# EAGLE design RPI_Clock (EAGLE 8.5.2)
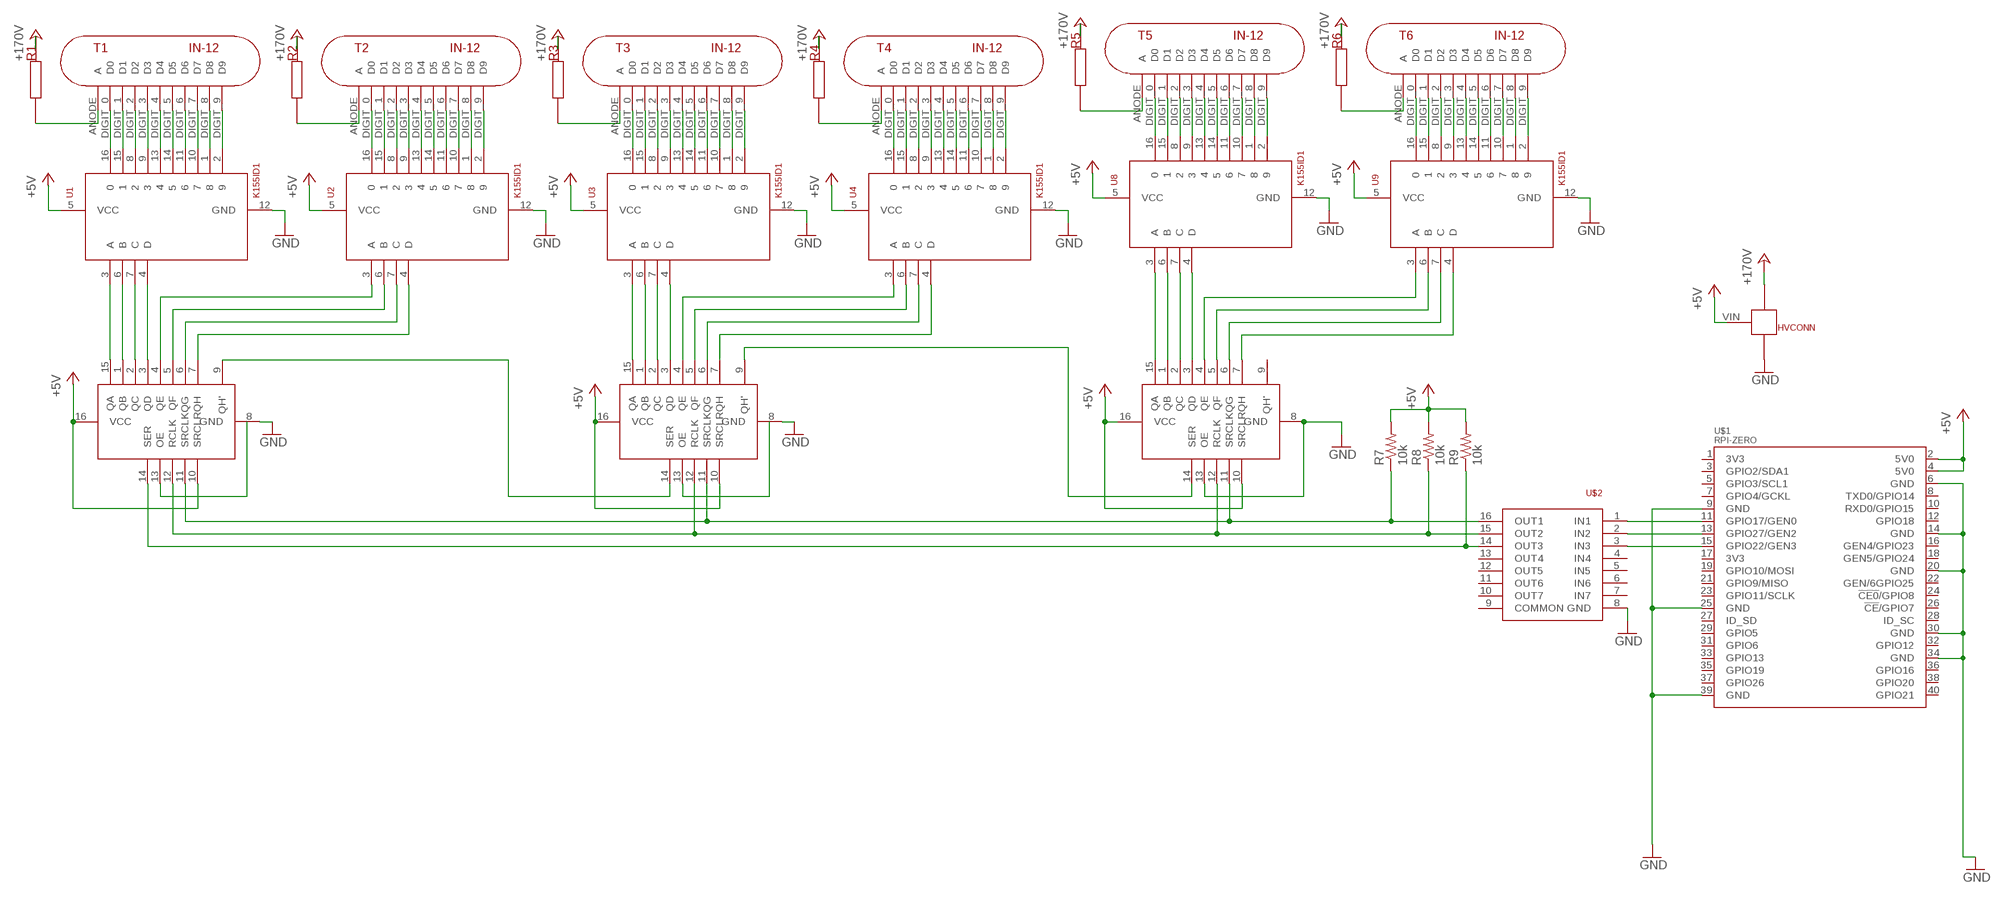
[diagram p0: schematic, sheet 1]

## Parts
HVCONN  HV_CONNECTOR  [HV_CONNECTOR]
R1  5,6K  ANODE_RESISTOR  [ANODE_RESISTOR]
R2  5,6K  ANODE_RESISTOR  [ANODE_RESISTOR]
R3  5,6K  ANODE_RESISTOR  [ANODE_RESISTOR]
R4  5,6K  ANODE_RESISTOR  [ANODE_RESISTOR]
R5  5,6K  ANODE_RESISTOR  [ANODE_RESISTOR]
R6  5,6K  ANODE_RESISTOR  [ANODE_RESISTOR]
R7  10k  RESISTOR0805  [0805]
R8  10k  RESISTOR0805  [0805]
R9  10k  RESISTOR0805  [0805]
T1  IN-12  [IN-12]
T2  IN-12  [IN-12]
T3  IN-12  [IN-12]
T4  IN-12  [IN-12]
T5  IN-12  [IN-12]
T6  IN-12  [IN-12]
U1  K155ID1  [DIP16-2.54-19.2X7.62MM]
U2  K155ID1  [DIP16-2.54-19.2X7.62MM]
U3  K155ID1  [DIP16-2.54-19.2X7.62MM]
U4  K155ID1  [DIP16-2.54-19.2X7.62MM]
U6  74HC595  [DIL16]
U7  74HC595  [DIL16]
U8  K155ID1  [DIP16-2.54-19.2X7.62MM]
U9  K155ID1  [DIP16-2.54-19.2X7.62MM]
U11  74HC595  [DIL16]
U$1  RPI-ZERO  [RASP_PI_ZERO_BOARD_FULL]
U$2  ULN2003D1013TR  [SO16-NARROW]

## Nets
+5V: HVCONN.VIN R7.2 R8.2 R9.2 U1.5(VCC) U2.5(VCC) U3.5(VCC) U4.5(VCC) U6.10(SRCLR) U6.16(VCC) U7.10(SRCLR) U7.16(VCC) U8.5(VCC) U9.5(VCC) U11.10(SRCLR) U11.16(VCC) U$1.2(5V0) U$1.4(5V0)
+24V: HVCONN.+170V R1.P$2 R2.P$2 R3.P$2 R4.P$2 R5.P$2 R6.P$2 ; supply symbol labelled +170V
GND: HVCONN.GND U1.12(GND) U2.12(GND) U3.12(GND) U4.12(GND) U6.8(GND) U7.8(GND) U8.12(GND) U9.12(GND) U11.8(GND) U11.13(OE) U$1.6(GND) U$1.9(GND) U$1.14(GND) U$1.20(GND) U$1.25(GND) U$1.30(GND) U$1.34(GND) U$1.39(GND) U$2.8(GND)
N$1: T1.DIGIT_9(D9) U1.2
N$2: T1.DIGIT_8(D8) U1.1
N$3: T1.DIGIT_7(D7) U1.10
N$4: T1.DIGIT_6(D6) U1.11
N$5: T1.DIGIT_5(D5) U1.14
N$6: T1.DIGIT_4(D4) U1.13
N$7: T1.DIGIT_3(D3) U1.9
N$8: T1.DIGIT_2(D2) U1.8
N$9: T1.DIGIT_1(D1) U1.15
N$10: T1.DIGIT_0(D0) U1.16
N$11: R1.P$1 T1.ANODE(A)
N$12: T2.DIGIT_9(D9) U2.2
N$13: T2.DIGIT_8(D8) U2.1
N$14: T2.DIGIT_7(D7) U2.10
N$15: T2.DIGIT_6(D6) U2.11
N$16: T2.DIGIT_5(D5) U2.14
N$17: T2.DIGIT_4(D4) U2.13
N$18: T2.DIGIT_3(D3) U2.9
N$19: T2.DIGIT_2(D2) U2.8
N$20: T2.DIGIT_1(D1) U2.15
N$21: T2.DIGIT_0(D0) U2.16
N$22: R2.P$1 T2.ANODE(A)
N$23: T3.DIGIT_9(D9) U3.2
N$24: T3.DIGIT_8(D8) U3.1
N$25: T3.DIGIT_7(D7) U3.10
N$26: T3.DIGIT_6(D6) U3.11
N$27: T3.DIGIT_5(D5) U3.14
N$28: T3.DIGIT_4(D4) U3.13
N$29: T3.DIGIT_3(D3) U3.9
N$30: T3.DIGIT_2(D2) U3.8
N$31: T3.DIGIT_1(D1) U3.15
N$32: T3.DIGIT_0(D0) U3.16
N$33: R3.P$1 T3.ANODE(A)
N$34: T4.DIGIT_9(D9) U4.2
N$35: T4.DIGIT_8(D8) U4.1
N$36: T4.DIGIT_7(D7) U4.10
N$37: T4.DIGIT_6(D6) U4.11
N$38: T4.DIGIT_5(D5) U4.14
N$39: T4.DIGIT_4(D4) U4.13
N$40: T4.DIGIT_3(D3) U4.9
N$41: T4.DIGIT_2(D2) U4.8
N$42: T4.DIGIT_1(D1) U4.15
N$43: T4.DIGIT_0(D0) U4.16
N$44: R4.P$1 T4.ANODE(A)
N$45: U6.13(OE)
N$46: U7.13(OE)
N$47: U$1.11(GPIO17/GEN0) U$2.1(IN1)
N$48: U$1.13(GPIO27/GEN2) U$2.2(IN2)
N$49: R7.1 U6.11(SRCLK) U7.11(SRCLK) U11.11(SRCLK) U$2.16(OUT1)
N$50: R8.1 U6.12(RCLK) U7.12(RCLK) U11.12(RCLK) U$2.15(OUT2)
N$51: R9.1 U6.14(SER) U$2.14(OUT3)
N$52: U$1.15(GPIO22/GEN3) U$2.3(IN3)
N$56: T5.DIGIT_9(D9) U8.2
N$57: T5.DIGIT_8(D8) U8.1
N$58: T5.DIGIT_7(D7) U8.10
N$59: T5.DIGIT_6(D6) U8.11
N$60: T5.DIGIT_5(D5) U8.14
N$61: T5.DIGIT_4(D4) U8.13
N$62: T5.DIGIT_3(D3) U8.9
N$63: T5.DIGIT_2(D2) U8.8
N$64: T5.DIGIT_1(D1) U8.15
N$65: T5.DIGIT_0(D0) U8.16
N$66: R5.P$1 T5.ANODE(A)
N$67: U1.3(A) U6.15(QA)
N$68: U1.6(B) U6.1(QB)
N$69: U1.7(C) U6.2(QC)
N$70: U1.4(D) U6.3(QD)
N$71: U2.3(A) U6.4(QE)
N$72: U2.6(B) U6.5(QF)
N$73: U2.7(C) U6.6(QG)
N$74: U2.4(D) U6.7(QH)
N$75: U3.3(A) U7.15(QA)
N$76: U3.6(B) U7.1(QB)
N$77: U3.7(C) U7.2(QC)
N$78: U3.4(D) U7.3(QD)
N$79: U4.3(A) U7.4(QE)
N$80: U4.6(B) U7.5(QF)
N$81: U4.7(C) U7.6(QG)
N$82: U4.4(D) U7.7(QH)
N$83: T6.DIGIT_9(D9) U9.2
N$84: T6.DIGIT_8(D8) U9.1
N$85: T6.DIGIT_7(D7) U9.10
N$86: T6.DIGIT_6(D6) U9.11
N$87: T6.DIGIT_5(D5) U9.14
N$88: T6.DIGIT_4(D4) U9.13
N$89: T6.DIGIT_3(D3) U9.9
N$90: T6.DIGIT_2(D2) U9.8
N$91: U6.9(QH') U7.14(SER)
N$92: T6.DIGIT_1(D1) U9.15
N$93: T6.DIGIT_0(D0) U9.16
N$94: R6.P$1 T6.ANODE(A)
N$95: U8.3(A) U11.15(QA)
N$96: U8.6(B) U11.1(QB)
N$97: U8.7(C) U11.2(QC)
N$98: U8.4(D) U11.3(QD)
N$99: U9.3(A) U11.4(QE)
N$100: U9.6(B) U11.5(QF)
N$101: U9.7(C) U11.6(QG)
N$102: U9.4(D) U11.7(QH)
N$106: U7.9(QH') U11.14(SER)
Unconnected: U11.9(QH') U$1.1(3V3) U$1.3(GPIO2/SDA1) U$1.5(GPIO3/SCL1) U$1.7(GPIO4/GCKL) U$1.8(TXD0/GPIO14) U$1.10(RXD0/GPIO15) U$1.12(GPIO18) U$1.16(GEN4/GPIO23) U$1.17(3V3) U$1.18(GEN5/GPIO24) U$1.19(GPIO10/MOSI) U$1.21(GPIO9/MISO) U$1.22(GEN/6GPIO25) U$1.23(GPIO11/SCLK) U$1.24(!CE0!/GPIO8) U$1.26(!CE!/GPIO7) U$1.27(ID_SD) U$1.28(ID_SC) U$1.29(GPIO5) U$1.31(GPIO6) U$1.32(GPIO12) U$1.33(GPIO13) U$1.35(GPIO19) U$1.36(GPIO16) U$1.37(GPIO26) U$1.38(GPIO20) U$1.40(GPIO21) U$2.4(IN4) U$2.5(IN5) U$2.6(IN6) U$2.7(IN7) U$2.9(COMMON) U$2.10(OUT7) U$2.11(OUT6) U$2.12(OUT5) U$2.13(OUT4)

## Library data of the parts
HVCONN = TimeExpander:HV_CONNECTOR
R1-R6 = TimeExpander:ANODE_RESISTOR: Anode resistor (Value is depending on drive voltage); VALUE: 22k
R7-R9 = EE_copy:RESISTOR
T1-T6 = TimeExpander:IN-12: Soviet IN-12 Nixie
U1-U4 U8 U9 = TimeExpander:K155ID1: Soviet version of SN74141 BCD to Decimal Decoder / Nixie Driver
U6 U7 U11 = TimeExpander:74HC595: 8-Bit Shift Register
U$1 = rpi-zero:RPI-ZERO
U$2 = EE_copy:ULN2003D1013TR

## Board
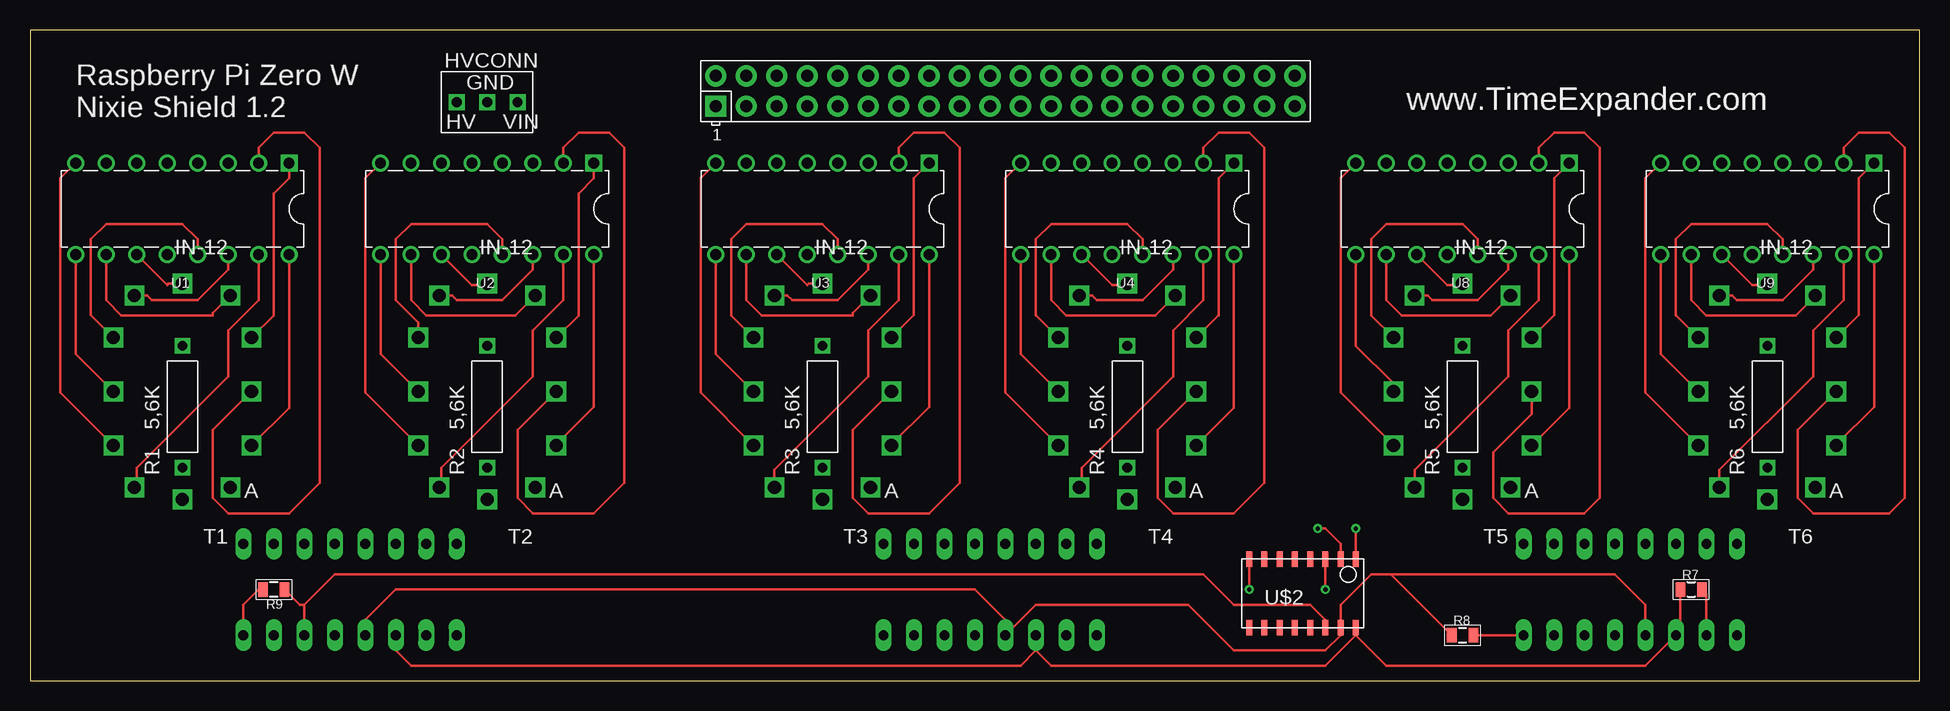
[diagram p1: board, top side]
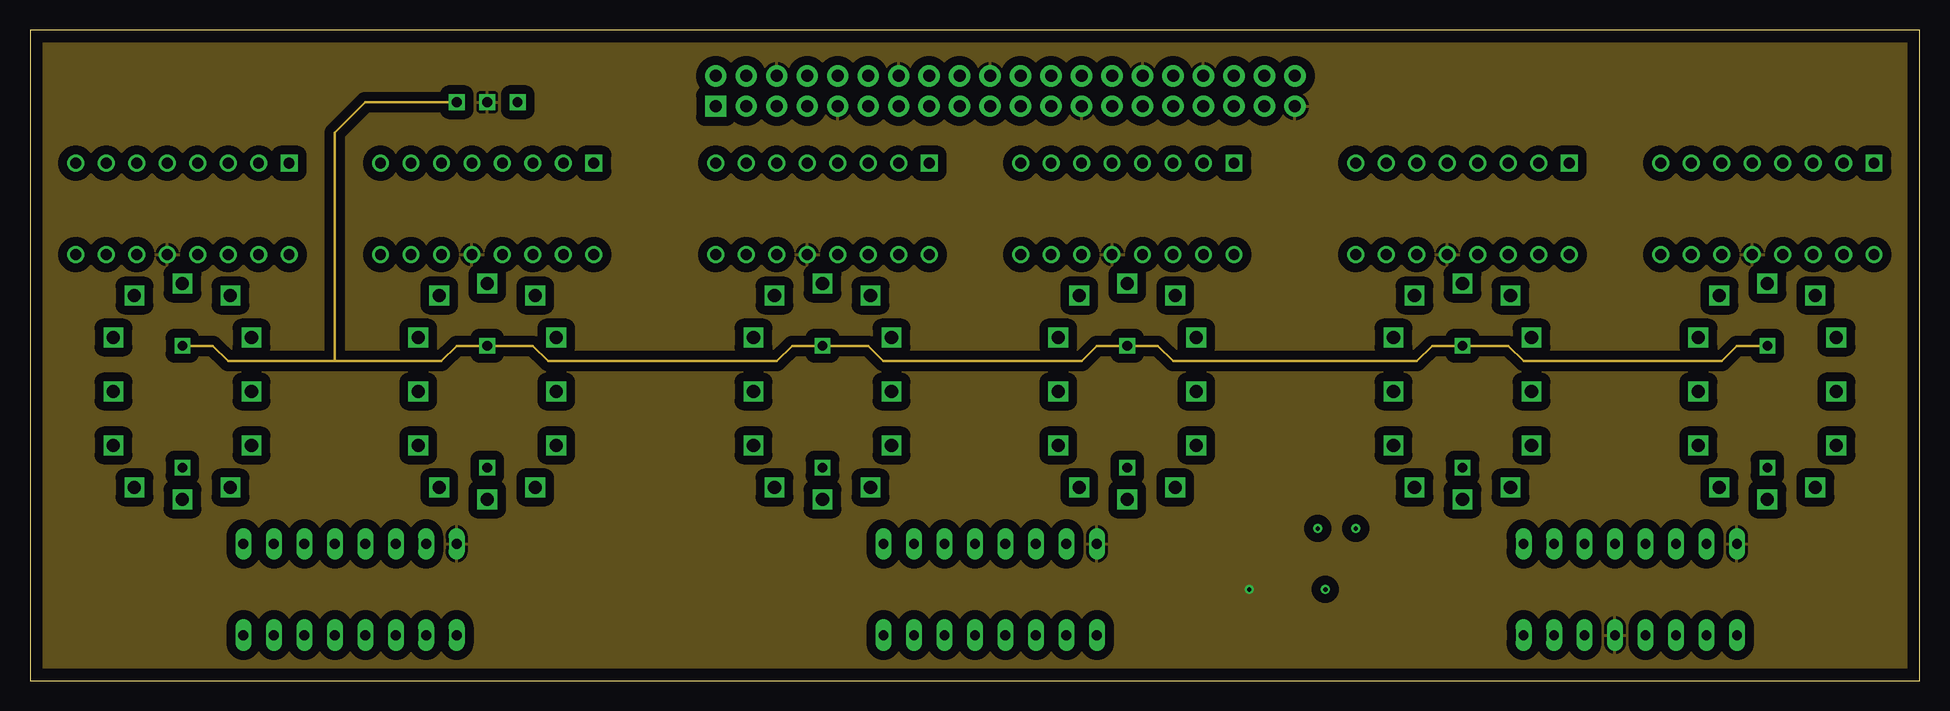
[diagram p2: board, inner layer GND]
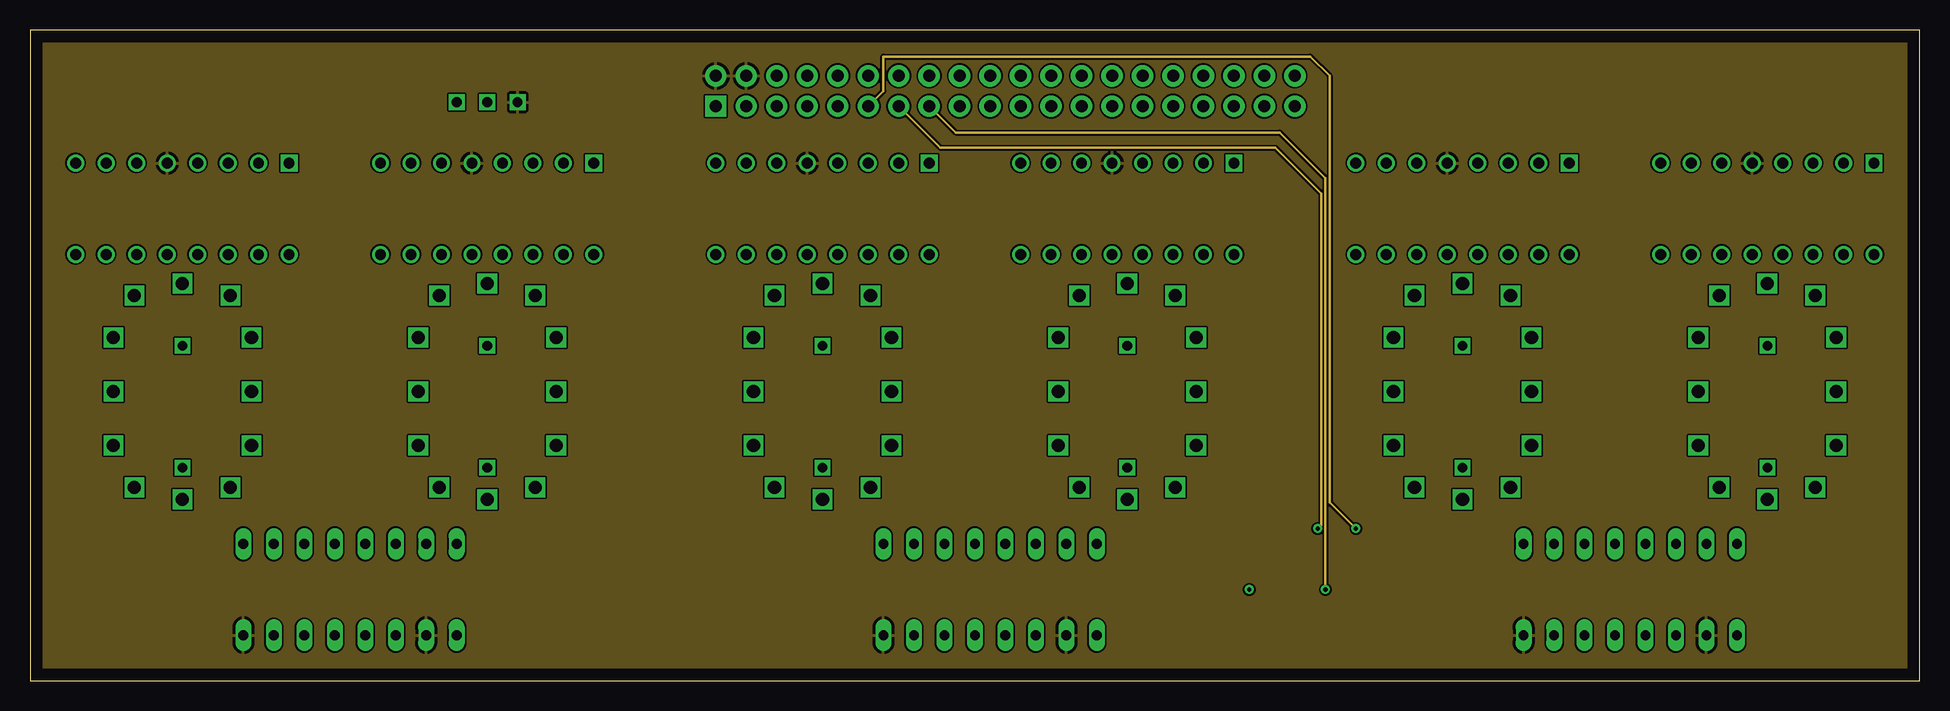
[diagram p3: board, inner layer +5V]
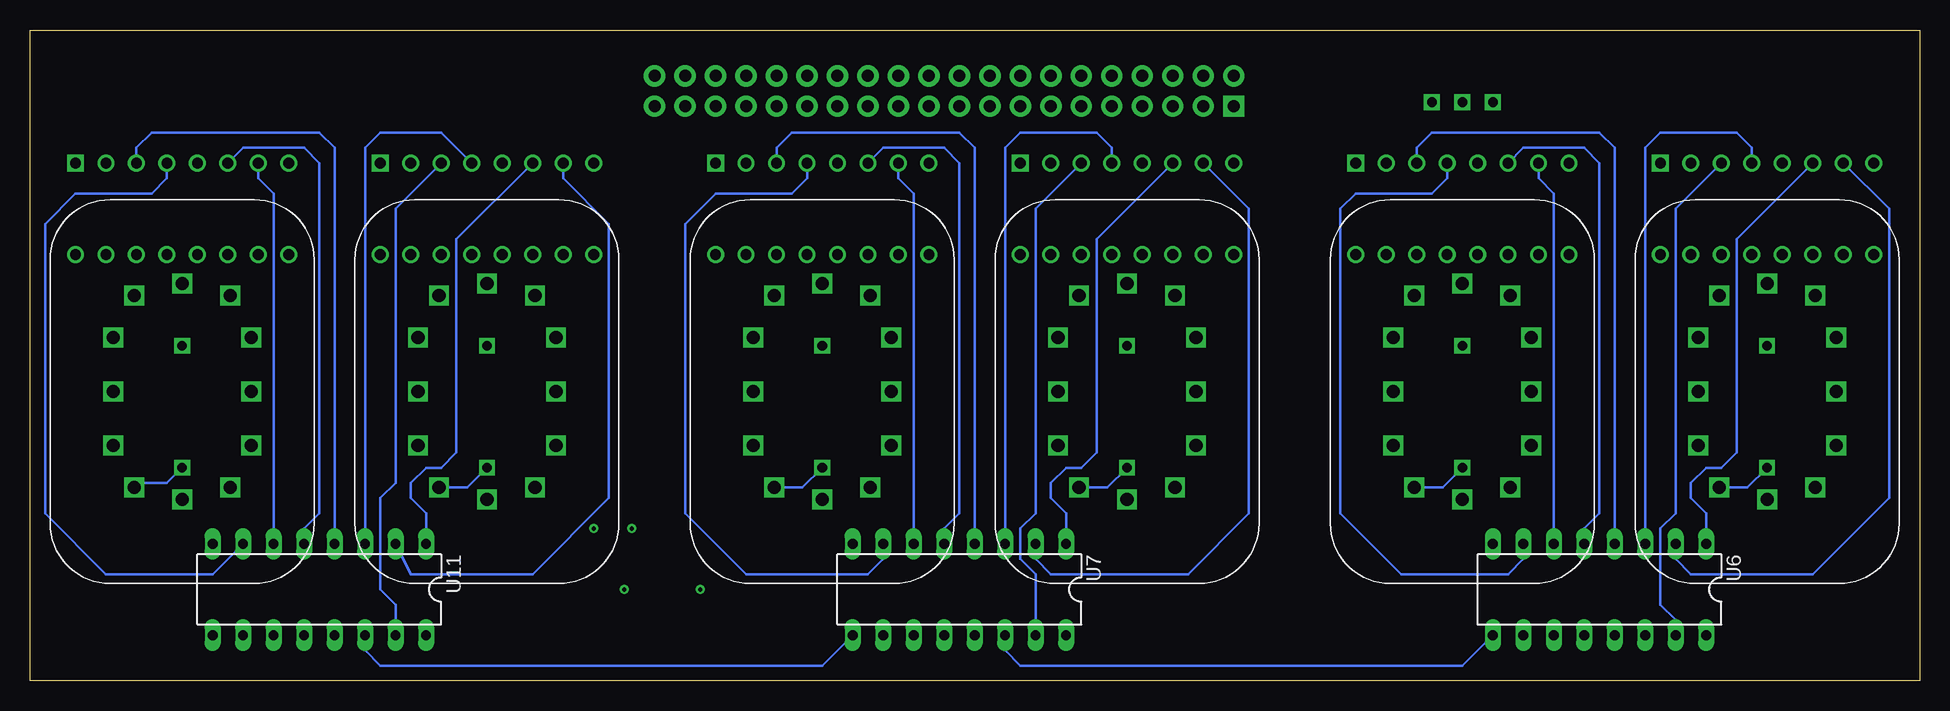
[diagram p4: board, bottom side, seen from below]

Size 157.46 x 54.28 mm. Coordinates in mm from the lower left corner, seen from the top.
Outline: 0,0 157.46,0 157.46,54.28 0,54.28 0,0
Copper layers (1*2*15*16): Top 0.035mm / dielectric 0.2mm / GND 0.035mm / dielectric 0.2mm / +5V 0.035mm / dielectric 0.2mm / Bottom 0.035mm
Design rules "default *": minimum track width 6mil, minimum drill 0.35mm, track to track 6mil, track to pad 6mil, pad to pad 6mil, via to via 6mil, smd to smd 6mil, copper to edge 40mil, drill to drill 6mil, minimum pad ring 10mil, minimum via ring 8mil, stop-mask expansion 4mil, vias tented up to drill 0mil, thermal gap 10mil

### Footprints (pad centres in the part's own frame; a part is rotated, then mirrored left to right if it is on the bottom)
HV_CONNECTOR = drill 0.8 square: +170V -5.08,2.54; GND -2.54,2.54; VIN 0,2.54
ANODE_RESISTOR = drill 0.8 square: P$1 0,0; P$2 10.16,0
0805 = smd 0.8 x 1.2: 1 -0.9,0; 2 0.9,0
IN-12 = drill 1.1 square: ANODE 4,-8; DIGIT_0 5.75,-4.5; DIGIT_1 -4,-8; DIGIT_2 -5.75,-4.5; DIGIT_3 -5.75,0; DIGIT_4 -5.75,4.5; DIGIT_5 -4,8; DIGIT_6 0,9; DIGIT_7 4,8; DIGIT_8 5.75,4.5; DIGIT_9 5.75,0; NC 0,-9
DIP16-2.54-19.2X7.62MM = drill 0.9 pad 1.4 square: 1 -8.89,-3.81 | drill 0.9 pad 1.4: 2 -6.35,-3.81; 3 -3.81,-3.81; 4 -1.27,-3.81; 5 1.27,-3.81; 6 3.81,-3.81; 7 6.35,-3.81; 8 8.89,-3.81; 9 8.89,3.81; 10 6.35,3.81; 11 3.81,3.81; 12 1.27,3.81; 13 -1.27,3.81; 14 -3.81,3.81; 15 -6.35,3.81; 16 -8.89,3.81
DIL16 = drill 0.813 long: 1 -8.89,-3.81; 2 -6.35,-3.81; 3 -3.81,-3.81; 4 -1.27,-3.81; 5 1.27,-3.81; 6 3.81,-3.81; 7 6.35,-3.81; 8 8.89,-3.81; 9 8.89,3.81; 10 6.35,3.81; 11 3.81,3.81; 12 1.27,3.81; 13 -1.27,3.81; 14 -3.81,3.81; 15 -6.35,3.81; 16 -8.89,3.81
RASP_PI_ZERO_BOARD_FULL = drill 1 pad 1.778 square: 1 0.75,4.91 | drill 1 pad 1.778: 2 0.75,7.45; 3 3.29,4.91; 4 3.29,7.45; 5 5.83,4.91; 6 5.83,7.45; 7 8.37,4.91; 8 8.37,7.45; 9 10.91,4.91; 10 10.91,7.45; 11 13.45,4.91; 12 13.45,7.45; 13 15.99,4.91; 14 15.99,7.45; 15 18.53,4.91; 16 18.53,7.45; 17 21.07,4.91; 18 21.07,7.45; 19 23.61,4.91; 20 23.61,7.45; 21 26.15,4.91; 22 26.15,7.45; 23 28.69,4.91; 24 28.69,7.45; 25 31.23,4.91; 26 31.23,7.45; 27 33.77,4.91; 28 33.77,7.45; 29 36.31,4.91; 30 36.31,7.45; 31 38.85,4.91; 32 38.85,7.45; 33 41.39,4.91; 34 41.39,7.45; 35 43.93,4.91; 36 43.93,7.45; 37 46.47,4.91; 38 46.47,7.45; 39 49.01,4.91; 40 49.01,7.45
SO16-NARROW = smd 1.27 x 0.5: 1 0,8.89; 2 0,7.62; 3 0,6.35; 4 0,5.08; 5 0,3.81; 6 0,2.54; 7 0,1.27; 8 0,0; 9 5.715,0; 10 5.715,1.27; 11 5.715,2.54; 12 5.715,3.81; 13 5.715,5.08; 14 5.715,6.35; 15 5.715,7.62; 16 5.715,8.89

### Placement (x,y rotation side)
HVCONN  40.64,45.72 0 top
R1  12.7,17.78 90 top
R2  38.1,17.78 90 top
R3  66.04,17.78 90 top
R4  91.44,17.78 90 top
R5  119.38,17.78 90 top
R6  144.78,17.78 90 top
R7  138.43,7.62 0 top
R8  119.38,3.81 0 top
R9  20.32,7.62 180 top
T1  12.7,24.13 0 top
T2  38.1,24.13 0 top
T3  66.04,24.13 0 top
T4  91.44,24.13 0 top
T5  119.38,24.13 0 top
T6  144.78,24.13 0 top
U1  12.7,39.37 180 top
U2  38.1,39.37 180 top
U3  66.04,39.37 180 top
U4  91.44,39.37 180 top
U6  26.67,7.62 180 bottom
U7  80.01,7.62 180 bottom
U8  119.38,39.37 180 top
U9  144.78,39.37 180 top
U11  133.35,7.62 180 bottom
U$1  56.4,43.01 0 top
U$2  101.6,10.16 270 top

### Tracks (layer width: path | path; a pad name or v marks a point on that pad's centre or on a via)
+5V
  Top 0.2: 17.78,2.91 U6.16 17.78,6.35 19.05,7.62 R9.2 | R7.2 139.7,7.25 U11.10 | R8.2 U11.16
  pour +5V: 0,0 0,100.33 158.75,100.33 158.75,0
+24V
  GND 0.2: R1.P$2 15.24,27.94 16.51,26.67 25.4,26.67 | 25.4,26.67 34.29,26.67 35.56,27.94 R2.P$2 41.91,27.94 43.18,26.67 62.23,26.67 63.5,27.94 R3.P$2 69.85,27.94 71.12,26.67 87.63,26.67 88.9,27.94 R4.P$2 93.98,27.94 95.25,26.67 115.57,26.67 116.84,27.94 R5.P$2 123.19,27.94 124.46,26.67 140.97,26.67 142.24,27.94 R6.P$2 | 25.4,26.67 25.4,45.72 27.94,48.26 HVCONN.+170V
GND  (via drill 0.35)
  Top 0.2: U$2.8 v101.6,7.62
  pour GND (isolate 0.75): 0,0 0,99.06 1.27,100.33 158.75,99.06 158.75,-1.27
N$1
  Top 0.2: T1.DIGIT_9 15.24,20.92 15.24,15.24 16.51,13.97 21.59,13.97 24.13,16.51 24.13,44.45 22.86,45.72 20.32,45.72 19.05,44.45 U1.2
N$2
  Top 0.2: T1.DIGIT_8 20.3,30.48 20.32,30.48 20.32,40.64 21.59,41.91 U1.1
N$3
  Top 0.2: T1.DIGIT_7 15.24,30.67 15.24,30.48 7.62,30.48 6.35,31.75 U1.10
N$4
  Top 0.2: 12.59,33.13 T1.DIGIT_6 11.54,33.13 11.43,33.02 U1.11
N$5
  Top 0.2: T1.DIGIT_5 9.78,32.13 10.16,31.75 13.97,31.75 16.51,34.29 U1.14
N$6
  Top 0.2: T1.DIGIT_4 5.08,30.5 5.08,36.83 6.35,38.1 12.7,38.1 13.97,36.83 U1.13
N$7
  Top 0.2: T1.DIGIT_3 3.81,27.27 U1.9
N$8
  Top 0.2: T1.DIGIT_2 2.54,24.04 2.54,41.91 U1.8
N$9
  Top 0.2: U1.15 19.05,31.75 16.51,29.21 16.51,25.4 8.89,17.78 8.89,16.32 T1.DIGIT_1
N$10
  Top 0.2: T1.DIGIT_0 21.59,22.77 U1.16
N$11
  Top 0.2: T1.ANODE 17.08,16.51
  Bottom 0.2: R1.P$1 14.35,16.13 T1.ANODE
N$12
  Top 0.2: T2.DIGIT_9 40.64,20.92 40.64,15.24 41.91,13.97 46.99,13.97 49.53,16.51 49.53,44.45 48.26,45.72 45.72,45.72 44.45,44.45 U2.2
N$13
  Top 0.2: U2.1 46.99,41.91 45.72,40.64 45.72,30.48 43.87,28.63 T2.DIGIT_8
N$14
  Top 0.2: T2.DIGIT_7 40.45,30.48 33.02,30.48 31.75,31.75 U2.10
N$15
  Top 0.2: U2.11 36.83,33.02 37.99,33.02 T2.DIGIT_6
N$16
  Top 0.2: T2.DIGIT_5 35.18,32.13 35.56,31.75 39.37,31.75 41.91,34.29 U2.14
N$17
  Top 0.2: T2.DIGIT_4 32.35,29.88 30.48,31.75 30.48,36.83 31.75,38.1 38.1,38.1 39.37,36.83 U2.13
N$18
  Top 0.2: T2.DIGIT_3 29.21,27.27 U2.9
N$19
  Top 0.2: T2.DIGIT_2 27.94,24.04 27.94,41.91 U2.8
N$20
  Top 0.2: T2.DIGIT_1 34.29,16.32 34.29,17.78 41.91,25.4 41.91,29.21 44.45,31.75 U2.15
N$21
  Top 0.2: U2.16 46.99,22.86 43.85,19.72 T2.DIGIT_0
N$22
  Bottom 0.2: R2.P$1 39.75,16.13 T2.ANODE
N$23
  Top 0.2: T3.DIGIT_9 68.58,20.92 68.58,15.24 69.85,13.97 74.93,13.97 77.47,16.51 77.47,44.45 76.2,45.72 73.66,45.72 72.39,44.45 U3.2
N$24
  Top 0.2: T3.DIGIT_8 73.66,30.5 73.66,41.91 U3.1
N$25
  Top 0.2: T3.DIGIT_7 68.58,30.67 68.58,30.48 60.96,30.48 59.69,31.75 U3.10
N$26
  Top 0.2: U3.11 64.77,33.02 64.88,33.13 T3.DIGIT_6
N$27
  Top 0.2: T3.DIGIT_5 63.12,32.13 63.5,31.75 67.31,31.75 69.85,34.29 U3.14
N$28
  Top 0.2: T3.DIGIT_4 58.44,30.48 58.42,30.48 58.42,36.83 59.69,38.1 66.04,38.1 67.31,36.83 U3.13
N$29
  Top 0.2: T3.DIGIT_3 57.15,27.27 U3.9
N$30
  Top 0.2: T3.DIGIT_2 55.88,24.04 55.88,41.91 U3.8
N$31
  Top 0.2: U3.15 72.39,31.75 69.85,29.21 69.85,25.4 62.04,17.59 T3.DIGIT_1
N$32
  Top 0.2: T3.DIGIT_0 71.79,19.72 74.93,22.86 U3.16
N$33
  Bottom 0.2: R3.P$1 67.69,16.13 T3.ANODE
N$34
  Top 0.2: T4.DIGIT_9 93.98,20.92 93.98,15.24 95.25,13.97 100.33,13.97 102.87,16.51 102.87,44.45 101.6,45.72 99.06,45.72 97.79,44.45 U4.2
N$35
  Top 0.2: T4.DIGIT_8 99.04,30.48 99.06,30.48 99.06,41.91 U4.1
N$36
  Top 0.2: T4.DIGIT_7 93.79,30.48 86.36,30.48 85.09,31.75 U4.10
N$37
  Top 0.2: U4.11 90.17,33.02 91.33,33.02 T4.DIGIT_6
N$38
  Top 0.2: T4.DIGIT_5 88.52,32.13 88.9,31.75 92.71,31.75 95.25,34.29 U4.14
N$39
  Top 0.2: T4.DIGIT_4 83.84,30.48 83.82,30.48 83.82,36.83 85.09,38.1 91.44,38.1 92.71,36.83 U4.13
N$40
  Top 0.2: T4.DIGIT_3 82.55,27.27 U4.9
N$41
  Top 0.2: T4.DIGIT_2 81.28,24.04 81.28,41.91 U4.8
N$42
  Top 0.2: U4.15 97.79,31.75 95.25,29.21 95.25,25.4 87.63,17.78 87.63,16.32 T4.DIGIT_1
N$43
  Top 0.2: T4.DIGIT_0 100.33,22.77 U4.16
N$44
  Bottom 0.2: R4.P$1 93.09,16.13 T4.ANODE
N$47  (via drill 0.35)
  Top 0.2: v110.49,12.7 U$2.1
  +5V 0.2: U$1.11 71.12,49.19 71.12,52.07 106.68,52.07 108.3,50.45 108.3,14.89 v110.49,12.7
N$48  (via drill 0.35)
  Top 0.2: U$2.2 109.22,11.43 107.95,12.7 v107.32,12.7
  +5V 0.2: U$1.13 75.86,44.45 103.79,44.45 107.6,40.64 107.6,12.98 v107.32,12.7
N$49
  Top 0.2: 30.48,5.08 U6.11 30.48,2.54 31.75,1.27 82.55,1.27 83.82,2.54 | 83.82,2.54 U7.11 | R7.1 137.53,4.18 U11.11 134.62,1.27 113.03,1.27 110.49,3.81 | 110.49,3.81 U$2.16 | 110.49,3.81 107.95,1.27 85.09,1.27 83.82,2.54
N$50
  Top 0.2: U6.12 27.94,5.08 30.48,7.62 78.74,7.62 81.28,5.08 U7.12 83.82,6.35 96.52,6.35 100.33,2.54 107.95,2.54 109.22,3.81 U$2.15 109.22,6.35 111.76,8.89 113.4,8.89 | U11.12 134.62,6.35 132.08,8.89 113.4,8.89 | R8.1 113.4,8.89
N$51
  Top 0.2: U6.14 22.86,6.35 | 22.86,6.35 25.4,8.89 97.79,8.89 100.33,6.35 106.68,6.35 107.95,5.08 U$2.14 | R9.1 22.49,6.35 22.86,6.35
N$52  (via drill 0.35)
  Top 0.2: v107.95,7.62 U$2.3
  +5V 0.2: U$1.15 77.13,45.72 104.14,45.72 107.95,41.91 v107.95,7.62
N$56
  Top 0.2: T5.DIGIT_9 125.13,22.26 121.92,19.05 121.92,15.24 123.19,13.97 129.54,13.97 130.81,15.24 130.81,44.45 129.54,45.72 127,45.72 125.73,44.45 U8.2
N$57
  Top 0.2: T5.DIGIT_8 127,30.5 127,41.91 U8.1
N$58
  Top 0.2: T5.DIGIT_7 121.73,30.48 114.3,30.48 113.03,31.75 U8.10
N$59
  Top 0.2: U8.11 118.11,33.02 119.27,33.02 T5.DIGIT_6
N$60
  Top 0.2: T5.DIGIT_5 116.46,32.13 116.84,31.75 120.65,31.75 123.19,34.29 U8.14
N$61
  Top 0.2: T5.DIGIT_4 111.78,30.48 111.76,30.48 111.76,36.83 113.03,38.1 119.38,38.1 120.65,36.83 U8.13
N$62
  Top 0.2: T5.DIGIT_3 113.63,24.8 110.49,27.94 U8.9
N$63
  Top 0.2: T5.DIGIT_2 109.22,24.04 109.22,41.91 U8.8
N$64
  Top 0.2: U8.15 125.73,31.75 123.19,29.21 123.19,25.4 115.38,17.59 T5.DIGIT_1
N$65
  Top 0.2: T5.DIGIT_0 128.27,22.77 U8.16
N$66
  Bottom 0.2: R5.P$1 121.03,16.13 T5.ANODE
N$67
  Bottom 0.2: U1.3 20.32,39.37 20.32,13.97 21.59,12.7 21.59,6.35 20.32,5.08 U6.15
N$68
  Bottom 0.2: U1.6 15.24,36.83 15.24,19.05 16.51,17.78 17.78,17.78 19.05,16.51 19.05,15.24 17.78,13.97 U6.1
N$69
  Bottom 0.2: U1.7 2.54,39.37 2.54,15.24 8.89,8.89 19.05,8.89 20.32,10.16 U6.2
N$70
  Bottom 0.2: U1.4 13.97,44.45 15.24,45.72 21.59,45.72 22.86,44.45 U6.3
N$71
  Bottom 0.2: U6.4 25.4,44.45 26.67,45.72 40.64,45.72 41.91,44.45 U2.3
N$72
  Bottom 0.2: U6.5 27.94,12.7 26.67,13.97 26.67,43.18 27.94,44.45 33.02,44.45 U2.6
N$73
  Bottom 0.2: U6.6 30.48,40.64 31.75,41.91 U2.7
N$74
  Bottom 0.2: U2.4 39.37,41.91 40.64,40.64 46.99,40.64 48.26,39.37 48.26,13.97 43.18,8.89 34.29,8.89 33.02,10.16 U6.7
N$75
  Bottom 0.2: U3.3 73.66,39.37 73.66,13.97 74.93,12.7 74.93,10.16 73.66,8.89 U7.15
N$76
  Bottom 0.2: U3.6 68.58,36.83 68.58,19.05 69.85,17.78 71.12,17.78 72.39,16.51 72.39,15.24 71.12,13.97 U7.1
N$77
  Bottom 0.2: U3.7 55.88,39.37 55.88,13.97 60.96,8.89 72.39,8.89 73.66,10.16 U7.2
N$78
  Bottom 0.2: U3.4 67.31,44.45 68.58,45.72 74.93,45.72 76.2,44.45 U7.3
N$79
  Bottom 0.2: U7.4 78.74,44.45 80.01,45.72 93.98,45.72 95.25,44.45 U4.3
N$80
  Bottom 0.2: U4.6 86.36,44.45 81.28,44.45 80.01,43.18 80.01,13.97 81.28,12.7 U7.5
N$81
  Bottom 0.2: U7.6 83.82,40.64 85.09,41.91 U4.7
N$82
  Bottom 0.2: U7.7 86.36,10.16 87.63,8.89 97.79,8.89 102.87,13.97 102.87,38.1 100.33,40.64 93.98,40.64 92.71,41.91 U4.4
N$83
  Top 0.2: T6.DIGIT_9 147.32,20.92 147.32,15.24 148.59,13.97 154.94,13.97 156.21,15.24 156.21,44.45 154.94,45.72 152.4,45.72 151.13,44.45 U9.2
N$84
  Top 0.2: T6.DIGIT_8 152.4,30.5 152.4,41.91 U9.1
N$85
  Top 0.2: T6.DIGIT_7 147.13,30.48 139.7,30.48 138.43,31.75 U9.10
N$86
  Top 0.2: U9.11 143.51,33.02 144.67,33.02 T6.DIGIT_6
N$87
  Top 0.2: T6.DIGIT_5 141.86,32.13 142.24,31.75 146.05,31.75 148.59,34.29 U9.14
N$88
  Top 0.2: T6.DIGIT_4 137.18,30.48 137.16,30.48 137.16,36.83 138.43,38.1 144.78,38.1 146.05,36.83 U9.13
N$89
  Top 0.2: T6.DIGIT_3 135.89,27.27 U9.9
N$90
  Top 0.2: T6.DIGIT_2 134.62,24.04 134.62,41.91 U9.8
N$91
  Bottom 0.2: U6.9 38.1,1.27 74.93,1.27 76.2,2.54 U7.14
N$92
  Top 0.2: U9.15 151.13,31.75 148.59,29.21 148.59,25.4 140.78,17.59 T6.DIGIT_1
N$93
  Top 0.2: T6.DIGIT_0 150.53,19.72 153.67,22.86 U9.16
N$94
  Bottom 0.2: R6.P$1 146.05,16.51 148.4,16.51 T6.ANODE
N$95
  Bottom 0.2: U8.3 127,39.37 127,16.51 128.27,15.24 128.27,7.62 127,6.35 U11.15
N$96
  Bottom 0.2: U11.1 124.46,13.97 125.73,15.24 125.73,16.51 124.46,17.78 123.19,17.78 121.92,19.05 121.92,36.83 U8.6
N$97
  Bottom 0.2: U11.2 125.73,8.89 115.57,8.89 109.22,15.24 109.22,38.1 113.03,41.91 U8.7
N$98
  Bottom 0.2: U8.4 123.19,45.72 128.27,45.72 129.54,44.45 U11.3
N$99
  Bottom 0.2: U11.4 132.08,44.45 133.35,45.72 147.32,45.72 148.59,44.45 U9.3
N$100
  Bottom 0.2: U9.6 139.7,44.45 134.62,44.45 133.35,43.18 133.35,13.97 134.62,12.7 U11.5
N$101
  Bottom 0.2: U11.6 137.16,40.64 138.43,41.91 U9.7
N$102
  Bottom 0.2: U11.7 142.24,8.89 151.13,8.89 156.21,13.97 156.21,38.1 153.67,40.64 147.32,40.64 146.05,41.91 U9.4
N$106
  Bottom 0.2: U7.9 91.44,1.27 128.27,1.27 129.54,2.54 U11.14

### Text on the board
tPlace: www.TimeExpander.com | Raspberry Pi Zero W / Nixie Shield 1.2